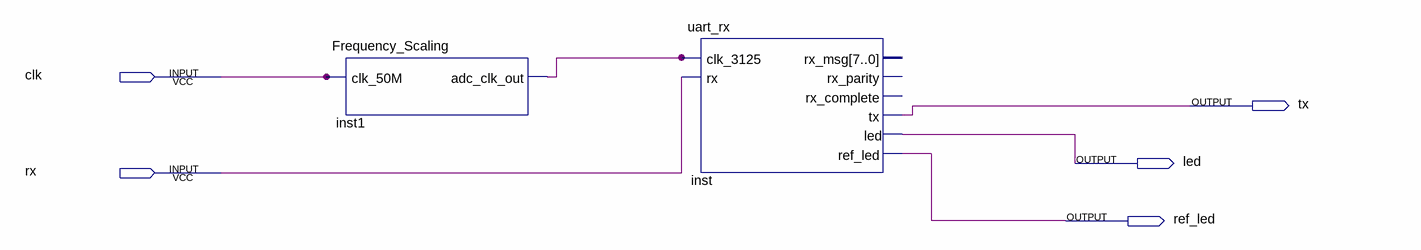
[diagram p0: schematic sheet]
// Quartus schematic rx.bdf as structural Verilog: 2 symbols, 5 pins
module rx (
  input  clk,
  input  rx,
  output tx,
  output led,
  output ref_led
);

  wire inst1_adc_clk_out;

  Frequency_Scaling inst1 (.clk_50M(clk), .adc_clk_out(inst1_adc_clk_out));
  uart_rx inst (
    .clk_3125(inst1_adc_clk_out), .rx(rx), .tx(tx), .led(led), .ref_led(ref_led));  // open: rx_msg, rx_parity, rx_complete
endmodule
